# EAGLE schematic hydroponics_schema (EAGLE 6.4)
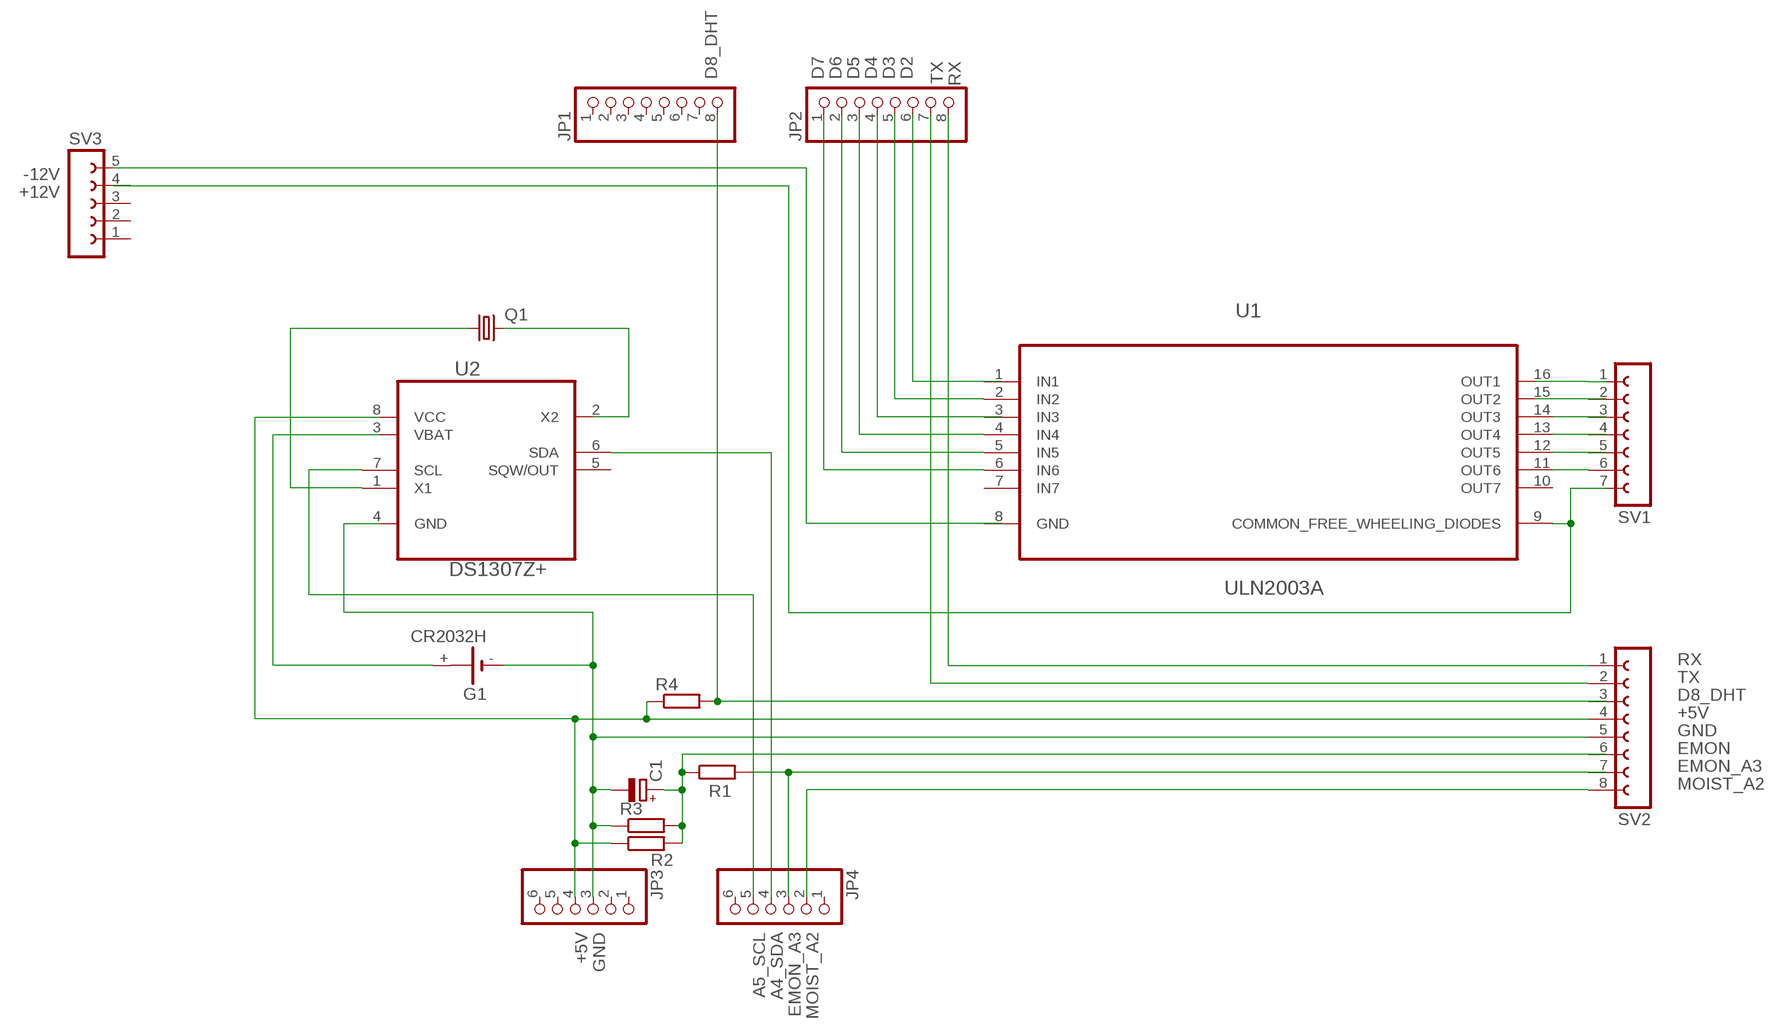
[diagram p0: schematic, sheet 1]

## Parts
C1  CPOL-EUE2.5-6  [E2,5-6]
G1  CR2032H  [CR2032H]
JP1  PINHD-1X8/90  [1X08/90]
JP2  PINHD-1X8/90  [1X08/90]
JP3  PINHD-1X6/90  [1X06/90]
JP4  PINHD-1X6/90  [1X06/90]
Q1  CRYSTALTC38H  [TC38H]
R1  R-EU_0207/10  [0207/10]
R2  R-EU_0207/10  [0207/10]
R3  R-EU_0207/10  [0207/10]
R4  R-EU_0207/10  [0207/10]
SV1  FE07-1  [FE07]
SV2  FE08-1  [FE08]
SV3  FE05-1  [FE05-1]
U1  ULN2003A  [DIP254P762X508-16]
U2  DS1307Z+  [SOIC127P600X175-8N]

## Nets
+5V: JP3.4 R2.1 R4.1 SV2.4
+12V: U1.9(COMMON_FREE_WHEELING_DIODES)
A4_SDA: JP4.4 U2.6(SDA)
A5_SCL: JP4.5 U2.7(SCL)
D2: JP2.6
D3: JP2.5 U1.2(IN2)
D4: JP2.4
D5: JP2.3 U1.4(IN4)
D6: JP2.2 U1.5(IN5)
D7: JP2.1 U1.6(IN6)
D8_DHT: JP1.8 R4.2
EMON: C1.+ R1.1 R2.2 R3.2
EMON_A3: JP4.3 R1.2
GND: C1.- G1.- JP3.3 R3.1 SV2.5
MOIST_A2: JP4.2 SV2.8
N$1: G1.+
N$2: Q1.2
N$3: Q1.1 U2.1(X1)
N$9: U1.14(OUT3)
N$10: U1.13(OUT4)
N$11: U1.12(OUT5)
N$12: SV1.6 U1.11(OUT6)
N$15: SV1.1
RX: JP2.8 SV2.1
TX: JP2.7 SV2.2
Unconnected: G1.+@1(+) JP1.1 JP1.2 JP1.3 JP1.4 JP1.5 JP1.6 JP1.7 JP3.1 JP3.2 JP3.5 JP3.6 JP4.1 JP4.6 SV1.2 SV1.3 SV1.4 SV1.5 SV1.7 SV2.3 SV2.6 SV2.7 SV3.1 SV3.2 SV3.3 SV3.4 SV3.5 U1.1(IN1) U1.3(IN3) U1.7(IN7) U1.8(GND) U1.10(OUT7) U1.15(OUT2) U1.16(OUT1) U2.2(X2) U2.3(VBAT) U2.4(GND) U2.5(SQW/OUT)

## Power pins joined to a net without a drawn wire
VCC: U2.8(VCC)

## Library data of the parts
C1 = rcl:CPOL-EU: POLARIZED CAPACITOR, European symbol; OC_NEWARK: unknown
G1 = battery:CR2032H: LI BATTERY Varta; OC_NEWARK: unknown
JP1 JP2 = pinhead:PINHD-1X8: PIN HEADER; OC_NEWARK: unknown
JP3 JP4 = pinhead:PINHD-1X6: PIN HEADER; OC_NEWARK: unknown
Q1 = crystal:CRYSTAL: CRYSTAL; OC_FARNELL: unknown; OC_NEWARK: unknown
R1-R4 = resistor:R-EU_: RESISTOR, European symbol; OC_NEWARK: unknown
SV1 = con-lsta:FE07-1: FEMALE HEADER; OC_FARNELL: unknown; OC_NEWARK: unknown
SV2 = con-lsta:FE08-1: FEMALE HEADER; OC_FARNELL: unknown; OC_NEWARK: unknown
SV3 = con-lsta:FE05-1: FEMALE HEADER; OC_FARNELL: unknown; OC_NEWARK: unknown
U1 = ST Microelctronics_By_element14_Batch_1:ULN2003A: Seven Darlington array; MF: Arrow Electronics; MPN: ULN2003A; OC_FARNELL: 1094421; OC_NEWARK: 89K1130; PACKAGE: 16-DIP; SUPPLIER: STMICROELECTRONICS
U2 = Maxim_By_element14_Batch_1:DS1307Z+: 64 x 8, Serial, I2C Real-Time Clock; MF: DALLAS SEMICONDUCTOR; MPN: DS1307Z+; OC_FARNELL: 9726322; OC_NEWARK: 08J6234; PACKAGE: SOIC-8; SUPPLIER: Maxim